# EAGLE design CHIPPROTO (EAGLE 6.5.0)
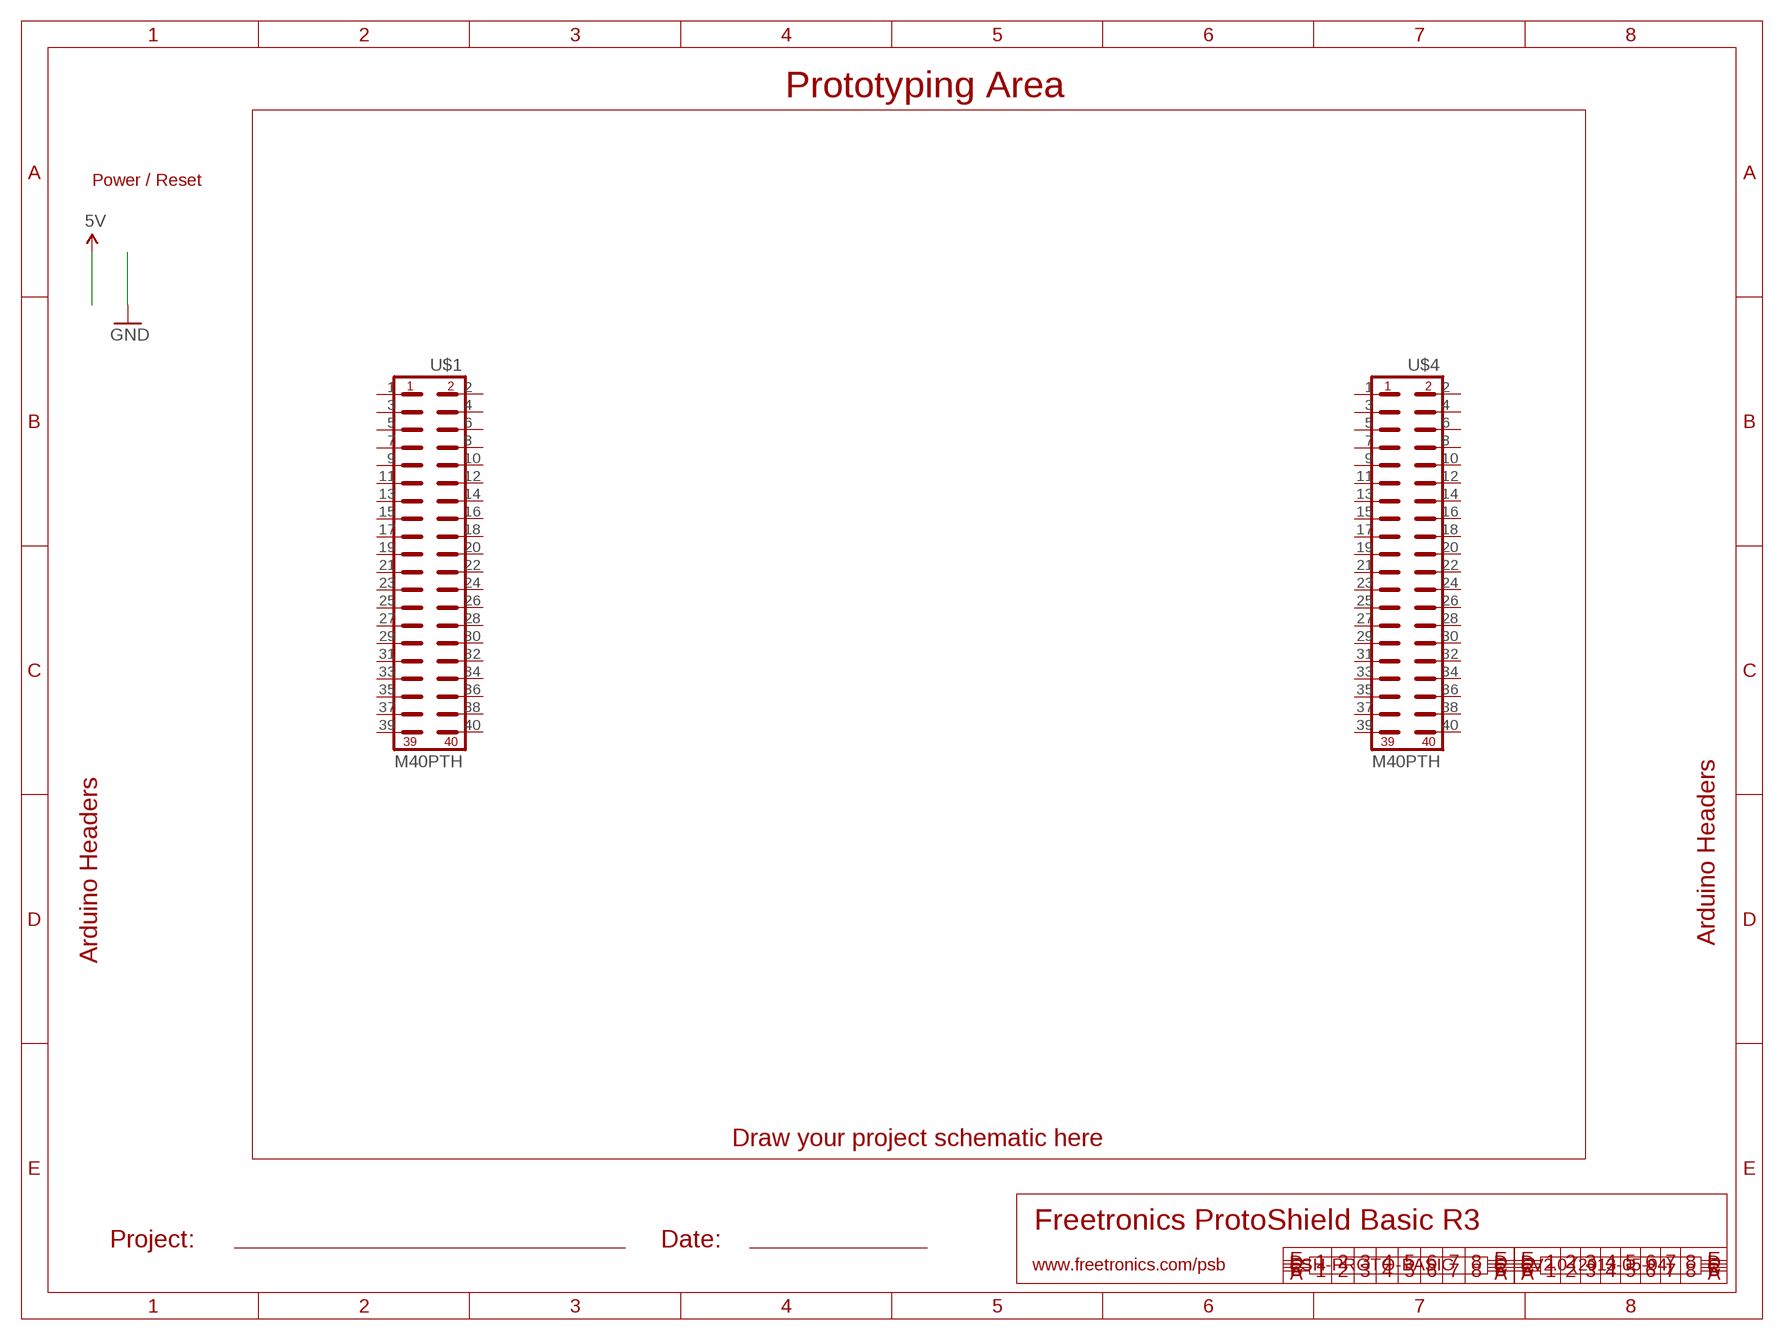
[diagram p0: schematic, sheet 1]

## Parts
U$1  M40PTH  [2X20]
U$4  M40PTH  [2X20]
Unconnected: U$1.1 U$1.2 U$1.3 U$1.4 U$1.5 U$1.6 U$1.7 U$1.8 U$1.9 U$1.10 U$1.11 U$1.12 U$1.13 U$1.14 U$1.15 U$1.16 U$1.17 U$1.18 U$1.19 U$1.20 U$1.21 U$1.22 U$1.23 U$1.24 U$1.25 U$1.26 U$1.27 U$1.28 U$1.29 U$1.30 U$1.31 U$1.32 U$1.33 U$1.34 U$1.35 U$1.36 U$1.37 U$1.38 U$1.39 U$1.40 U$4.1 U$4.2 U$4.3 U$4.4 U$4.5 U$4.6 U$4.7 U$4.8 U$4.9 U$4.10 U$4.11 U$4.12 U$4.13 U$4.14 U$4.15 U$4.16 U$4.17 U$4.18 U$4.19 U$4.20 U$4.21 U$4.22 U$4.23 U$4.24 U$4.25 U$4.26 U$4.27 U$4.28 U$4.29 U$4.30 U$4.31 U$4.32 U$4.33 U$4.34 U$4.35 U$4.36 U$4.37 U$4.38 U$4.39 U$4.40

## Notes on the sheet
- Prototyping Area
- Power / Reset
- Arduino Headers
- Arduino Headers
- Draw your project schematic here
- Freetronics ProtoShield Basic R3
- Project: | Date:
- www.freetronics.com/psb | SH-PROTO-BASIC | V2.0 (2013-05-04)

## Library data of the parts
U$1 U$4 = freetronics-jon:M40

## Board
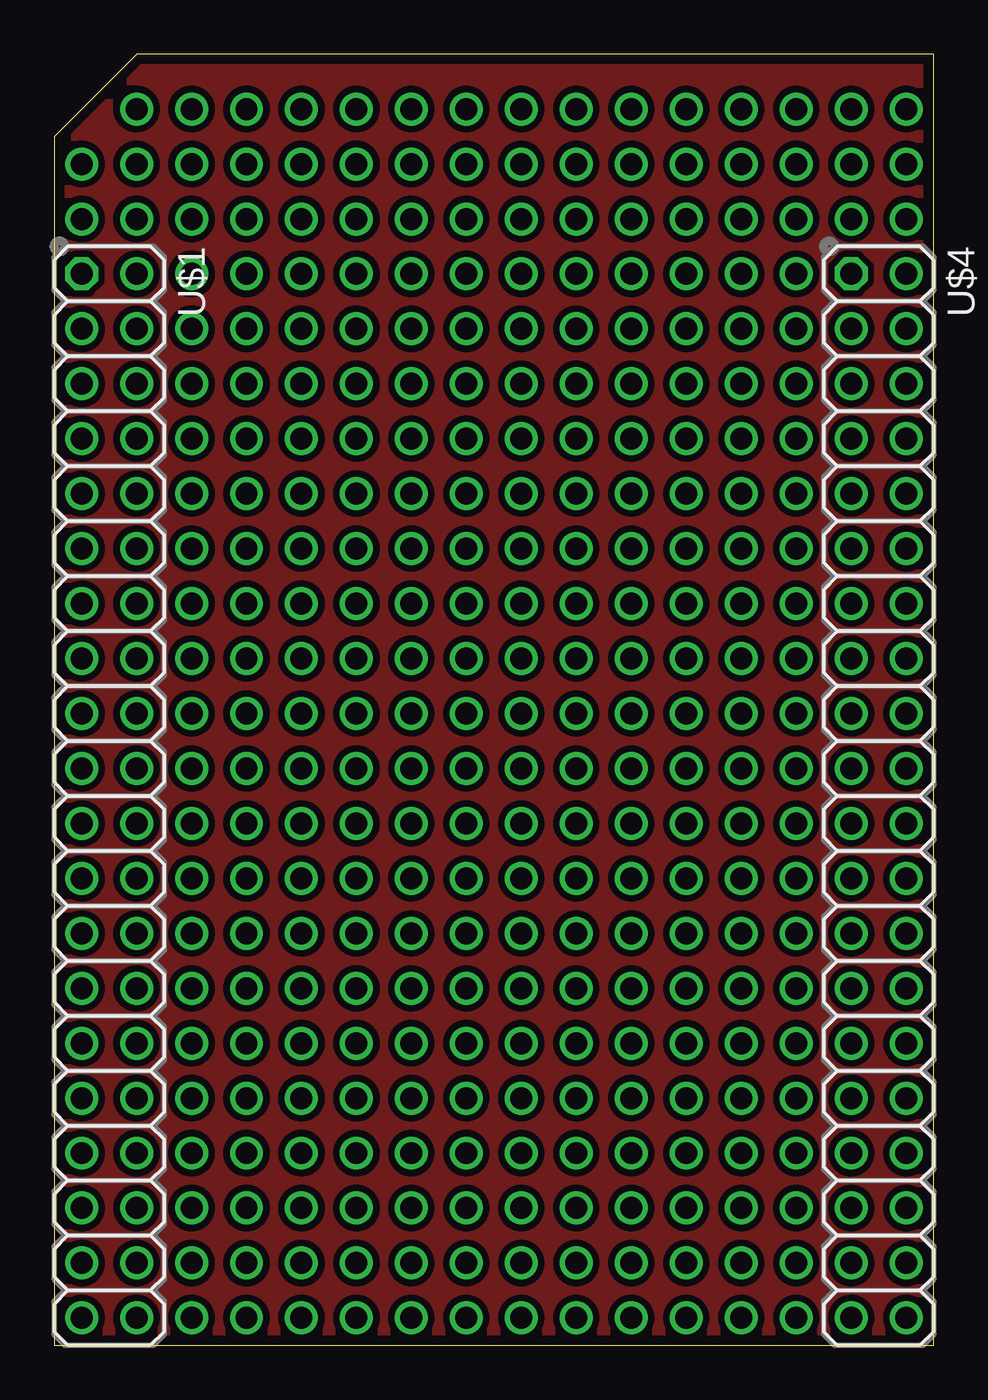
[diagram p1: board, top side]
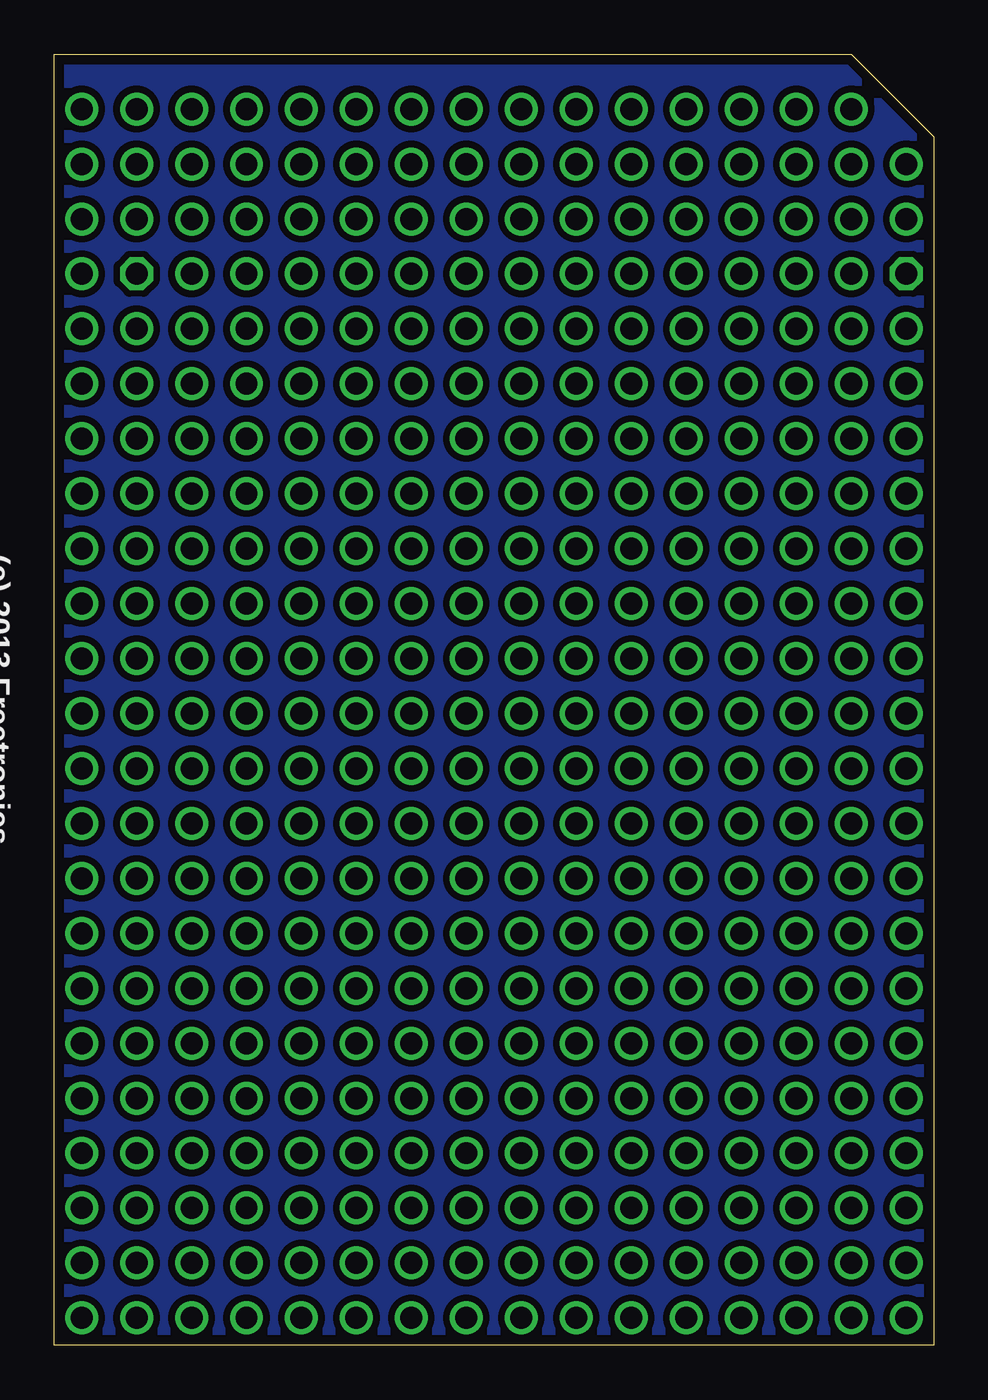
[diagram p2: board, bottom side, seen from below]

Size 40.64 x 59.69 mm. Coordinates in mm from the lower left corner, seen from the top.
Outline: 0,0 40.64,0 40.64,59.69 3.81,59.69 0,55.88 0,0
Copper layers (1*16): Top 0.035mm / dielectric 1.5mm / Bottom 0.035mm
Design rules "default *": minimum track width 10mil, minimum drill 24mil, track to track 12mil, track to pad 12mil, pad to pad 12mil, via to via 12mil, smd to smd 8mil, copper to edge 18mil, drill to drill 8mil, minimum pad ring 10mil, minimum via ring 8mil, stop-mask expansion 4mil, vias tented up to drill 0mil, thermal gap 10mil

### Footprints (pad centres in the part's own frame; a part is rotated, then mirrored left to right if it is on the bottom)
2X20 = drill 1.016 octagon: 1 0,0 | drill 1.016: 2 0,2.54; 3 2.54,0; 4 2.54,2.54; 5 5.08,0; 6 5.08,2.54; 7 7.62,0; 8 7.62,2.54; 9 10.16,0; 10 10.16,2.54; 11 12.7,0; 12 12.7,2.54; 13 15.24,0; 14 15.24,2.54; 15 17.78,0; 16 17.78,2.54; 17 20.32,0; 18 20.32,2.54; 19 22.86,0; 20 22.86,2.54; 21 25.4,0; 22 25.4,2.54; 23 27.94,0; 24 27.94,2.54; 25 30.48,0; 26 30.48,2.54; 27 33.02,0; 28 33.02,2.54; 29 35.56,0; 30 35.56,2.54; 31 38.1,0; 32 38.1,2.54; 33 40.64,0; 34 40.64,2.54; 35 43.18,0; 36 43.18,2.54; 37 45.72,0; 38 45.72,2.54; 39 48.26,0; 40 48.26,2.54

### Placement (x,y rotation side)
U$1  1.27,49.53 270 top
U$4  36.83,49.53 270 top

### Tracks (layer width: path | path; a pad name or v marks a point on that pad's centre or on a via)
GND
  pour Bottom: 0,55.88 3.81,59.69 40.64,59.69 40.64,0 0,0
  pour Top: 0,55.88 3.81,59.69 40.64,59.69 40.64,0 0,0
N$1  (via drill 1.02)
  other vias: 34.29,24.13
N$2  (via drill 1.02)
  other vias: 34.29,26.67
N$3  (via drill 1.02)
  other vias: 34.29,29.21
N$4  (via drill 1.02)
  other vias: 34.29,31.75
N$5  (via drill 1.02)
  other vias: 34.29,34.29
N$6  (via drill 1.02)
  other vias: 34.29,36.83
N$7  (via drill 1.02)
  other vias: 34.29,39.37
N$8  (via drill 1.02)
  other vias: 34.29,41.91
N$9  (via drill 1.02)
  other vias: 34.29,44.45
N$10  (via drill 1.02)
  other vias: 34.29,46.99
N$11  (via drill 1.02)
  other vias: 34.29,49.53
N$12  (via drill 1.02)
  other vias: 31.75,6.35
N$13  (via drill 1.02)
  other vias: 29.21,6.35
N$14  (via drill 1.02)
  other vias: 26.67,6.35
N$15  (via drill 1.02)
  other vias: 31.75,24.13
N$16  (via drill 1.02)
  other vias: 29.21,24.13
N$17  (via drill 1.02)
  other vias: 26.67,24.13
N$18  (via drill 1.02)
  other vias: 24.13,24.13
N$19  (via drill 1.02)
  other vias: 21.59,24.13
N$20  (via drill 1.02)
  other vias: 19.05,24.13
N$21  (via drill 1.02)
  other vias: 16.51,24.13
N$22  (via drill 1.02)
  other vias: 24.13,6.35
N$23  (via drill 1.02)
  other vias: 21.59,6.35
N$24  (via drill 1.02)
  other vias: 19.05,6.35
N$25  (via drill 1.02)
  other vias: 16.51,6.35
N$26  (via drill 1.02)
  other vias: 31.75,8.89
N$27  (via drill 1.02)
  other vias: 29.21,8.89
N$28  (via drill 1.02)
  other vias: 26.67,8.89
N$29  (via drill 1.02)
  other vias: 24.13,8.89
N$30  (via drill 1.02)
  other vias: 21.59,8.89
N$31  (via drill 1.02)
  other vias: 31.75,26.67
N$32  (via drill 1.02)
  other vias: 29.21,26.67
N$33  (via drill 1.02)
  other vias: 26.67,26.67
N$34  (via drill 1.02)
  other vias: 24.13,26.67
N$35  (via drill 1.02)
  other vias: 21.59,26.67
N$36  (via drill 1.02)
  other vias: 19.05,26.67
N$37  (via drill 1.02)
  other vias: 16.51,26.67
N$38  (via drill 1.02)
  other vias: 19.05,8.89
N$39  (via drill 1.02)
  other vias: 16.51,8.89
N$40  (via drill 1.02)
  other vias: 31.75,11.43
N$41  (via drill 1.02)
  other vias: 29.21,11.43
N$42  (via drill 1.02)
  other vias: 26.67,11.43
N$43  (via drill 1.02)
  other vias: 24.13,11.43
N$44  (via drill 1.02)
  other vias: 21.59,11.43
N$45  (via drill 1.02)
  other vias: 19.05,11.43
N$46  (via drill 1.02)
  other vias: 16.51,11.43
N$47  (via drill 1.02)
  other vias: 31.75,29.21
N$48  (via drill 1.02)
  other vias: 29.21,29.21
N$49  (via drill 1.02)
  other vias: 26.67,29.21
N$50  (via drill 1.02)
  other vias: 24.13,29.21
N$51  (via drill 1.02)
  other vias: 21.59,29.21
N$52  (via drill 1.02)
  other vias: 19.05,29.21
N$53  (via drill 1.02)
  other vias: 16.51,29.21
N$54  (via drill 1.02)
  other vias: 31.75,13.97
N$55  (via drill 1.02)
  other vias: 29.21,13.97
N$56  (via drill 1.02)
  other vias: 26.67,13.97
N$57  (via drill 1.02)
  other vias: 24.13,13.97
N$58  (via drill 1.02)
  other vias: 21.59,13.97
N$59  (via drill 1.02)
  other vias: 19.05,13.97
N$60  (via drill 1.02)
  other vias: 16.51,13.97
N$61  (via drill 1.02)
  other vias: 31.75,16.51
N$62  (via drill 1.02)
  other vias: 29.21,16.51
N$63  (via drill 1.02)
  other vias: 31.75,31.75
N$64  (via drill 1.02)
  other vias: 29.21,31.75
N$65  (via drill 1.02)
  other vias: 26.67,31.75
N$66  (via drill 1.02)
  other vias: 24.13,31.75
N$67  (via drill 1.02)
  other vias: 21.59,31.75
N$68  (via drill 1.02)
  other vias: 19.05,31.75
N$69  (via drill 1.02)
  other vias: 16.51,31.75
N$70  (via drill 1.02)
  other vias: 26.67,16.51
N$71  (via drill 1.02)
  other vias: 24.13,16.51
N$72  (via drill 1.02)
  other vias: 21.59,16.51
N$73  (via drill 1.02)
  other vias: 19.05,16.51
N$74  (via drill 1.02)
  other vias: 16.51,16.51
N$75  (via drill 1.02)
  other vias: 31.75,19.05
N$76  (via drill 1.02)
  other vias: 29.21,19.05
N$77  (via drill 1.02)
  other vias: 26.67,19.05
N$78  (via drill 1.02)
  other vias: 24.13,19.05
N$79  (via drill 1.02)
  other vias: 31.75,34.29
N$80  (via drill 1.02)
  other vias: 29.21,34.29
N$81  (via drill 1.02)
  other vias: 26.67,34.29
N$82  (via drill 1.02)
  other vias: 24.13,34.29
N$83  (via drill 1.02)
  other vias: 21.59,34.29
N$84  (via drill 1.02)
  other vias: 19.05,34.29
N$85  (via drill 1.02)
  other vias: 16.51,34.29
N$86  (via drill 1.02)
  other vias: 21.59,19.05
N$87  (via drill 1.02)
  other vias: 19.05,19.05
N$88  (via drill 1.02)
  other vias: 16.51,19.05
N$89  (via drill 1.02)
  other vias: 31.75,21.59
N$90  (via drill 1.02)
  other vias: 29.21,21.59
N$91  (via drill 1.02)
  other vias: 26.67,21.59
N$92  (via drill 1.02)
  other vias: 24.13,21.59
N$93  (via drill 1.02)
  other vias: 21.59,21.59
N$94  (via drill 1.02)
  other vias: 19.05,21.59
N$95  (via drill 1.02)
  other vias: 31.75,36.83
N$96  (via drill 1.02)
  other vias: 29.21,36.83
N$97  (via drill 1.02)
  other vias: 26.67,36.83
N$98  (via drill 1.02)
  other vias: 24.13,36.83
N$99  (via drill 1.02)
  other vias: 21.59,36.83
N$100  (via drill 1.02)
  other vias: 19.05,36.83
N$101  (via drill 1.02)
  other vias: 16.51,36.83
N$102  (via drill 1.02)
  other vias: 16.51,21.59
N$103  (via drill 1.02)
  other vias: 13.97,6.35
N$104  (via drill 1.02)
  other vias: 13.97,8.89
N$105  (via drill 1.02)
  other vias: 13.97,11.43
N$106  (via drill 1.02)
  other vias: 13.97,13.97
N$107  (via drill 1.02)
  other vias: 13.97,16.51
N$108  (via drill 1.02)
  other vias: 13.97,19.05
N$109  (via drill 1.02)
  other vias: 13.97,21.59
N$110  (via drill 1.02)
  other vias: 11.43,6.35
N$111  (via drill 1.02)
  other vias: 31.75,39.37
N$112  (via drill 1.02)
  other vias: 29.21,39.37
N$113  (via drill 1.02)
  other vias: 26.67,39.37
N$114  (via drill 1.02)
  other vias: 24.13,39.37
N$115  (via drill 1.02)
  other vias: 21.59,39.37
N$116  (via drill 1.02)
  other vias: 19.05,39.37
N$117  (via drill 1.02)
  other vias: 16.51,39.37
N$118  (via drill 1.02)
  other vias: 11.43,8.89
N$119  (via drill 1.02)
  other vias: 11.43,11.43
N$120  (via drill 1.02)
  other vias: 11.43,13.97
N$121  (via drill 1.02)
  other vias: 11.43,16.51
N$122  (via drill 1.02)
  other vias: 11.43,19.05
N$123  (via drill 1.02)
  other vias: 11.43,21.59
N$124  (via drill 1.02)
  other vias: 8.89,6.35
N$125  (via drill 1.02)
  other vias: 8.89,8.89
N$126  (via drill 1.02)
  other vias: 8.89,11.43
N$127  (via drill 1.02)
  other vias: 31.75,41.91
N$128  (via drill 1.02)
  other vias: 29.21,41.91
N$129  (via drill 1.02)
  other vias: 26.67,41.91
N$130  (via drill 1.02)
  other vias: 24.13,41.91
N$131  (via drill 1.02)
  other vias: 21.59,41.91
N$132  (via drill 1.02)
  other vias: 19.05,41.91
N$133  (via drill 1.02)
  other vias: 16.51,41.91
N$134  (via drill 1.02)
  other vias: 8.89,13.97
N$135  (via drill 1.02)
  other vias: 8.89,16.51
N$136  (via drill 1.02)
  other vias: 8.89,19.05
N$137  (via drill 1.02)
  other vias: 8.89,21.59
N$138  (via drill 1.02)
  other vias: 6.35,6.35
N$139  (via drill 1.02)
  other vias: 6.35,8.89
N$140  (via drill 1.02)
  other vias: 6.35,11.43
N$141  (via drill 1.02)
  other vias: 6.35,13.97
N$142  (via drill 1.02)
  other vias: 6.35,16.51
N$143  (via drill 1.02)
  other vias: 31.75,44.45
N$144  (via drill 1.02)
  other vias: 29.21,44.45
N$145  (via drill 1.02)
  other vias: 26.67,44.45
N$146  (via drill 1.02)
  other vias: 24.13,44.45
N$147  (via drill 1.02)
  other vias: 21.59,44.45
N$148  (via drill 1.02)
  other vias: 19.05,44.45
N$149  (via drill 1.02)
  other vias: 16.51,44.45
N$150  (via drill 1.02)
  other vias: 6.35,19.05
N$151  (via drill 1.02)
  other vias: 6.35,21.59
N$152  (via drill 1.02)
  other vias: 34.29,6.35
N$153  (via drill 1.02)
  other vias: 34.29,8.89
N$154  (via drill 1.02)
  other vias: 34.29,11.43
N$155  (via drill 1.02)
  other vias: 34.29,13.97
N$156  (via drill 1.02)
  other vias: 34.29,16.51
N$157  (via drill 1.02)
  other vias: 34.29,19.05
N$158  (via drill 1.02)
  other vias: 34.29,21.59
N$159  (via drill 1.02)
  other vias: 31.75,46.99
N$160  (via drill 1.02)
  other vias: 29.21,46.99
N$161  (via drill 1.02)
  other vias: 26.67,46.99
N$162  (via drill 1.02)
  other vias: 24.13,46.99
N$163  (via drill 1.02)
  other vias: 21.59,46.99
N$164  (via drill 1.02)
  other vias: 19.05,46.99
N$165  (via drill 1.02)
  other vias: 16.51,46.99
N$166  (via drill 1.02)
  other vias: 31.75,1.27
N$167  (via drill 1.02)
  other vias: 29.21,1.27
N$168  (via drill 1.02)
  other vias: 26.67,1.27
N$169  (via drill 1.02)
  other vias: 24.13,1.27
N$170  (via drill 1.02)
  other vias: 21.59,1.27
N$171  (via drill 1.02)
  other vias: 19.05,1.27
N$172  (via drill 1.02)
  other vias: 16.51,1.27
N$173  (via drill 1.02)
  other vias: 31.75,3.81
N$174  (via drill 1.02)
  other vias: 29.21,3.81
N$175  (via drill 1.02)
  other vias: 31.75,49.53
N$176  (via drill 1.02)
  other vias: 29.21,49.53
N$177  (via drill 1.02)
  other vias: 26.67,49.53
N$178  (via drill 1.02)
  other vias: 24.13,49.53
N$179  (via drill 1.02)
  other vias: 21.59,49.53
N$180  (via drill 1.02)
  other vias: 19.05,49.53
N$181  (via drill 1.02)
  other vias: 16.51,49.53
N$182  (via drill 1.02)
  other vias: 26.67,3.81
N$183  (via drill 1.02)
  other vias: 24.13,3.81
N$184  (via drill 1.02)
  other vias: 21.59,3.81
N$185  (via drill 1.02)
  other vias: 19.05,3.81
N$186  (via drill 1.02)
  other vias: 16.51,3.81
N$187  (via drill 1.02)
  other vias: 13.97,1.27
N$188  (via drill 1.02)
  other vias: 13.97,3.81
N$189  (via drill 1.02)
  other vias: 11.43,1.27
N$190  (via drill 1.02)
  other vias: 11.43,3.81
N$191  (via drill 1.02)
  other vias: 8.89,1.27
N$192  (via drill 1.02)
  other vias: 8.89,3.81
N$193  (via drill 1.02)
  other vias: 6.35,1.27
N$194  (via drill 1.02)
  other vias: 6.35,3.81
N$195  (via drill 1.02)
  other vias: 34.29,1.27
N$196  (via drill 1.02)
  other vias: 34.29,3.81
N$197  (via drill 1.02)
  other vias: 36.83,52.07
N$198  (via drill 1.02)
  other vias: 34.29,52.07
N$199  (via drill 1.02)
  other vias: 31.75,52.07
N$200  (via drill 1.02)
  other vias: 29.21,52.07
N$201  (via drill 1.02)
  other vias: 26.67,52.07
N$202  (via drill 1.02)
  other vias: 24.13,52.07
N$203  (via drill 1.02)
  other vias: 21.59,52.07
N$204  (via drill 1.02)
  other vias: 13.97,24.13
N$205  (via drill 1.02)
  other vias: 13.97,26.67
N$206  (via drill 1.02)
  other vias: 13.97,29.21
N$207  (via drill 1.02)
  other vias: 13.97,31.75
N$208  (via drill 1.02)
  other vias: 13.97,34.29
N$209  (via drill 1.02)
  other vias: 13.97,36.83
N$210  (via drill 1.02)
  other vias: 13.97,39.37
N$211  (via drill 1.02)
  other vias: 13.97,41.91
N$212  (via drill 1.02)
  other vias: 13.97,44.45
N$213  (via drill 1.02)
  other vias: 13.97,46.99
N$214  (via drill 1.02)
  other vias: 13.97,49.53
N$215  (via drill 1.02)
  other vias: 11.43,24.13
N$216  (via drill 1.02)
  other vias: 11.43,26.67
N$217  (via drill 1.02)
  other vias: 11.43,29.21
N$218  (via drill 1.02)
  other vias: 11.43,31.75
N$219  (via drill 1.02)
  other vias: 11.43,34.29
N$220  (via drill 1.02)
  other vias: 11.43,36.83
N$221  (via drill 1.02)
  other vias: 11.43,39.37
N$222  (via drill 1.02)
  other vias: 11.43,41.91
N$223  (via drill 1.02)
  other vias: 11.43,44.45
N$224  (via drill 1.02)
  other vias: 11.43,46.99
N$225  (via drill 1.02)
  other vias: 11.43,49.53
N$226  (via drill 1.02)
  other vias: 8.89,24.13
N$227  (via drill 1.02)
  other vias: 8.89,26.67
N$228  (via drill 1.02)
  other vias: 8.89,29.21
N$229  (via drill 1.02)
  other vias: 8.89,31.75
N$230  (via drill 1.02)
  other vias: 8.89,34.29
N$231  (via drill 1.02)
  other vias: 8.89,36.83
N$232  (via drill 1.02)
  other vias: 8.89,39.37
N$233  (via drill 1.02)
  other vias: 8.89,41.91
N$234  (via drill 1.02)
  other vias: 8.89,44.45
N$235  (via drill 1.02)
  other vias: 8.89,46.99
N$236  (via drill 1.02)
  other vias: 8.89,49.53
N$237  (via drill 1.02)
  other vias: 6.35,24.13
N$238  (via drill 1.02)
  other vias: 6.35,26.67
N$239  (via drill 1.02)
  other vias: 6.35,29.21
N$240  (via drill 1.02)
  other vias: 6.35,31.75
N$241  (via drill 1.02)
  other vias: 6.35,34.29
N$242  (via drill 1.02)
  other vias: 6.35,36.83
N$243  (via drill 1.02)
  other vias: 6.35,39.37
N$244  (via drill 1.02)
  other vias: 6.35,41.91
N$245  (via drill 1.02)
  other vias: 6.35,44.45
N$246  (via drill 1.02)
  other vias: 6.35,46.99
N$247  (via drill 1.02)
  other vias: 6.35,49.53
N$248  (via drill 1.02)
  other vias: 36.83,54.61
N$249  (via drill 1.02)
  other vias: 34.29,54.61
N$250  (via drill 1.02)
  other vias: 31.75,54.61
N$251  (via drill 1.02)
  other vias: 29.21,54.61
N$252  (via drill 1.02)
  other vias: 26.67,54.61
N$253  (via drill 1.02)
  other vias: 24.13,54.61
N$254  (via drill 1.02)
  other vias: 21.59,54.61
N$255  (via drill 1.02)
  other vias: 36.83,57.15
N$256  (via drill 1.02)
  other vias: 34.29,57.15
N$257  (via drill 1.02)
  other vias: 31.75,57.15
N$258  (via drill 1.02)
  other vias: 29.21,57.15
N$259  (via drill 1.02)
  other vias: 26.67,57.15
N$260  (via drill 1.02)
  other vias: 24.13,57.15
N$261  (via drill 1.02)
  other vias: 21.59,57.15
N$262  (via drill 1.02)
  other vias: 19.05,52.07
N$263  (via drill 1.02)
  other vias: 19.05,54.61
N$264  (via drill 1.02)
  other vias: 19.05,57.15
N$265  (via drill 1.02)
  other vias: 16.51,52.07
N$266  (via drill 1.02)
  other vias: 16.51,54.61
N$267  (via drill 1.02)
  other vias: 16.51,57.15
N$268  (via drill 1.02)
  other vias: 13.97,52.07
N$269  (via drill 1.02)
  other vias: 13.97,54.61
N$270  (via drill 1.02)
  other vias: 13.97,57.15
N$271  (via drill 1.02)
  other vias: 11.43,52.07
N$272  (via drill 1.02)
  other vias: 11.43,54.61
N$273  (via drill 1.02)
  other vias: 11.43,57.15
N$274  (via drill 1.02)
  other vias: 39.37,52.07
N$275  (via drill 1.02)
  other vias: 39.37,54.61
N$276  (via drill 1.02)
  other vias: 39.37,57.15
N$277  (via drill 1.02)
  other vias: 8.89,52.07
N$278  (via drill 1.02)
  other vias: 8.89,54.61
N$279  (via drill 1.02)
  other vias: 8.89,57.15
N$280  (via drill 1.02)
  other vias: 6.35,52.07
N$281  (via drill 1.02)
  other vias: 6.35,54.61
N$282  (via drill 1.02)
  other vias: 6.35,57.15
N$283  (via drill 1.02)
  other vias: 3.81,52.07
N$284  (via drill 1.02)
  other vias: 3.81,54.61
N$285  (via drill 1.02)
  other vias: 3.81,57.15
N$286  (via drill 1.02)
  other vias: 1.27,52.07
N$287  (via drill 1.02)
  other vias: 1.27,54.61

### Text on the board
tPlace: v2.0 | ProtoShield Basic R3
bPlace: (c) 2013 Freetronics